# EasyEDA Pro project Complete_project.epro, board PCB8
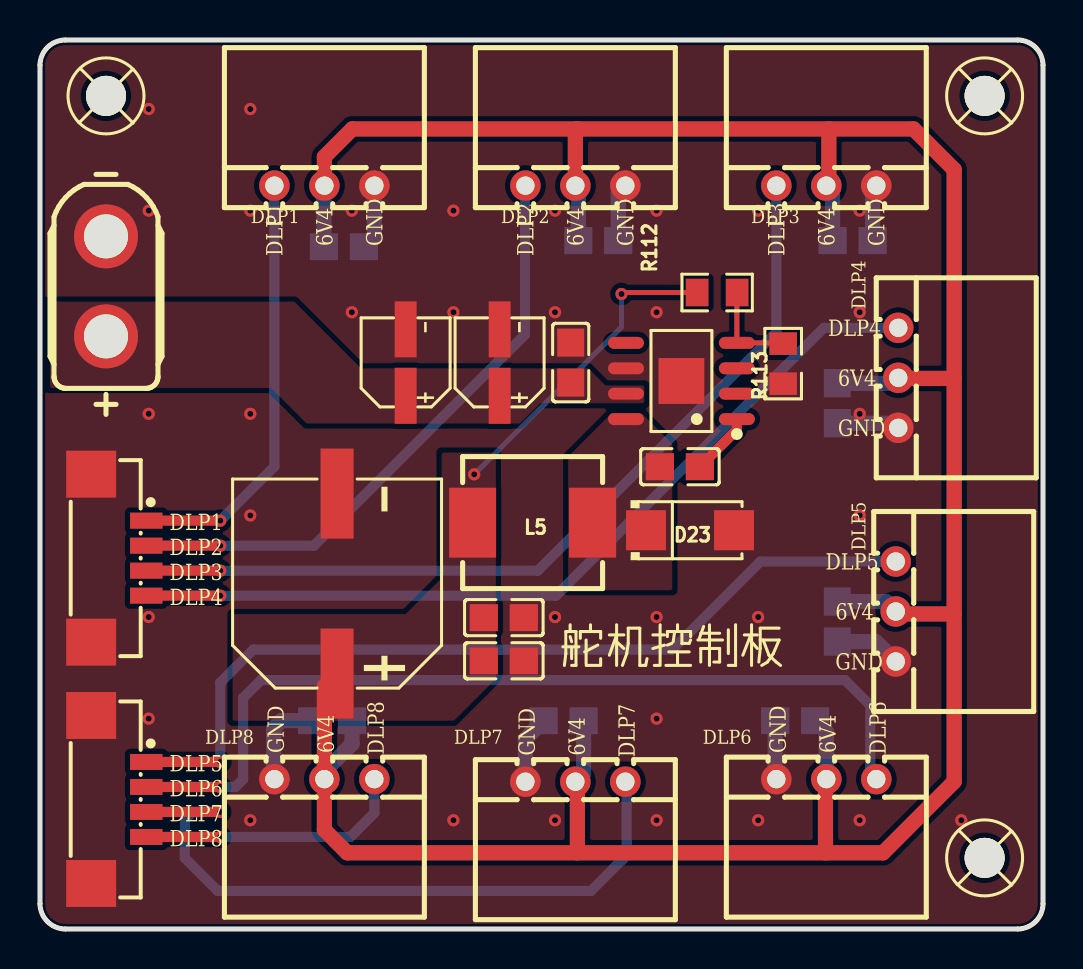
[diagram p20: board, top side]
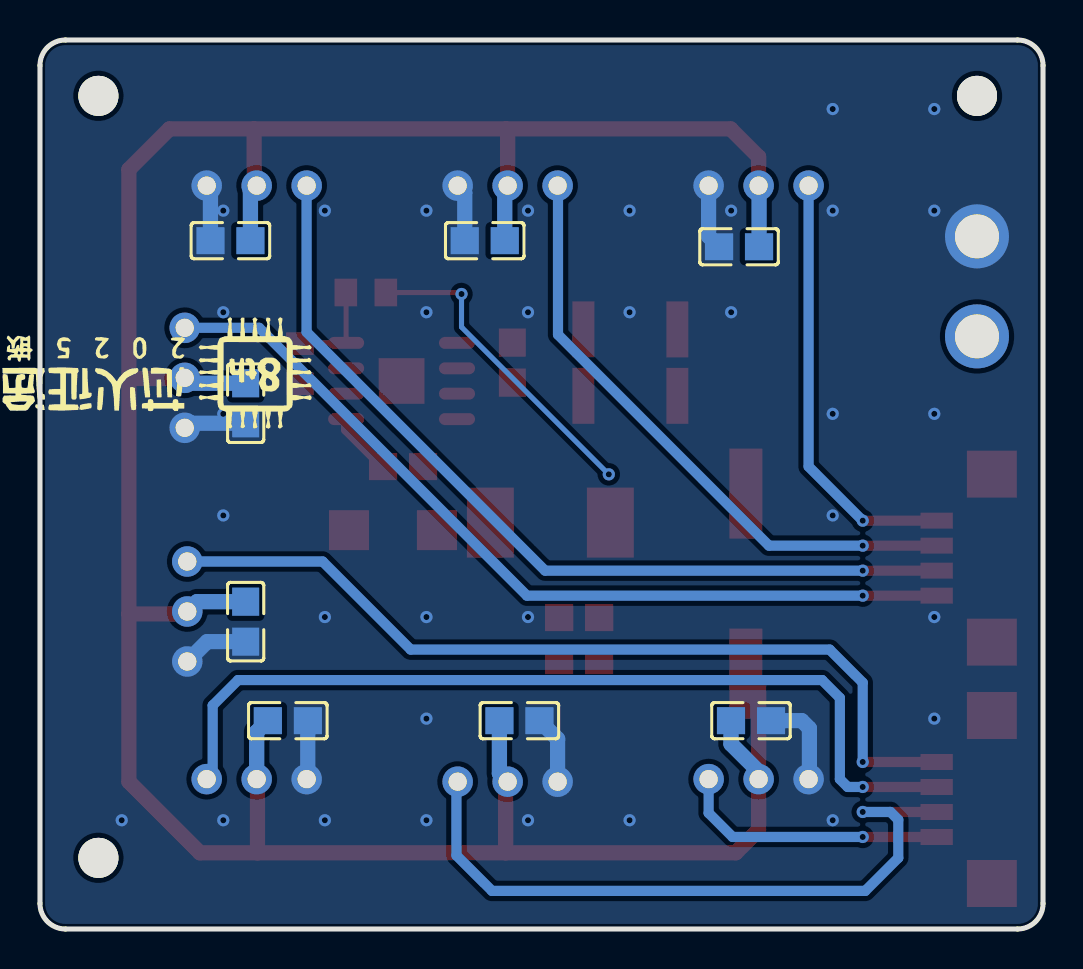
[diagram p21: board, bottom side, seen from below]

Outline 50.16 x 44.45 mm; copper layers: Top Layer, Bottom Layer. Coordinates in mm from the lower left corner of the outline.
Outline path: 0,43.18 0,1.27 arc(0.37,0.37) 1.27,0 48.9,0 arc(49.79,0.37) 50.16,1.27 50.16,43.18 arc(49.79,44.08) 48.9,44.45 1.27,44.45 arc(0.37,44.08) 0,43.18
Stack: Top Layer 0.035mm / Dielectric1 1.51mm FR4 er 4.5 / Bottom Layer 0.035mm

## Design rules (mm)
template: 自定义配置
spacing copperThickness1oz (default): track to track 0.102, other pairs 0.152 to 0.3
spacing copperThickness2oz: track to track 0.203, other pairs 0.152 to 0.3
track width copperThickness1oz (default): min 0.127, default 0.254, max 2.54
track width copperThickness2oz: min 0.203, default 0.254, max 2.54
differential pair differentialPair (default): width min 0.127, default 0.254, max 2.54; gap min 0.152, default 0.152
via viaSize (default): diameter min 0.5, default 0.61, max 10; hole min 0.3, default 0.305, max 6.3

## Placement (name value [footprint] x y rotation side)
C131  4.7uF  [CAP-SMD_BD4.0-L4.3-W4.3-LS5.0-FD]  22.99 28.32 90 top
C132  100nF  [C0805]  26.54 28.32 270 top
C134  100nF  [C0805]  23.2 13.41 180 top
C135  470uF  [CAP-SMD_BD10.0-L10.3-W10.3-LS11.3-FD]  14.86 17.27 90 top
C136  100nF  [C0805]  23.2 15.57 180 top
C137  4.7uF  [CAP-SMD_BD4.0-L4.3-W4.3-LS5.0-FD]  18.29 28.32 90 top
C139  100nF  [C0805]  32 23.11 180 top
C141  100nF  [C0805]  14.6 10.42 0 bottom
C142  100nF  [C0805]  15.2 34.11 180 bottom
C143  100nF  [C0805]  27.92 34.42 180 bottom
C144  100nF  [C0805]  40.64 34.42 180 bottom
C145  100nF  [C0805]  39.88 15.37 90 bottom
C146  100nF  [C0805]  37.77 10.42 0 bottom
C147  100nF  [C0805]  26.19 10.42 0 bottom
C148  100nF  [C0805]  39.88 26.29 90 bottom
CN1  XT30UPB-F30.G.Y  [CONN-TH_XT30UPB-F]  3.3 32.13 90 top
CN111  HC-1.25-4PLT  [CONN-SMD_4P-P1.25_HCTL_HC-1.25-4PLT]  3.94 18.54 270 top
CN112  HC-1.25-4PLT  [CONN-SMD_4P-P1.25_HCTL_HC-1.25-4PLT]  3.94 6.48 270 top
D23  SS56  [SMA_L4.3-W2.6-LS5.2-RD]  32.51 19.94 0 top
DLP1  HC-5264-3AW  [CONN-TH_3P-P2.50_HCTL_HC-5264-3AW]  14.22 37.17 0 top
DLP2  HC-5264-3AW  [CONN-TH_3P-P2.50_HCTL_HC-5264-3AW]  26.78 37.17 0 top
DLP3  HC-5264-3AW  [CONN-TH_3P-P2.50_HCTL_HC-5264-3AW]  39.33 37.17 0 top
DLP4  HC-5264-3AW  [CONN-TH_3P-P2.50_HCTL_HC-5264-3AW]  42.93 27.56 270 top
DLP5  HC-5264-3AW  [CONN-TH_3P-P2.50_HCTL_HC-5264-3AW]  42.8 15.88 270 top
DLP6  HC-5264-3AW  [CONN-TH_3P-P2.50_HCTL_HC-5264-3AW]  39.33 7.49 180 top
DLP7  HC-5264-3AW  [CONN-TH_3P-P2.50_HCTL_HC-5264-3AW]  26.78 7.37 180 top
DLP8  HC-5264-3AW  [CONN-TH_3P-P2.50_HCTL_HC-5264-3AW]  14.22 7.49 180 top
L5  10uH  [IND-SMD_L7.3-W6.8]  24.64 20.32 180 top
R112  5.1K  [R0805]  33.87 31.82 180 top
R113  1.2K  [R0805]  37.17 28.27 90 top
SCREW1  -  [M2螺丝]  3.3 41.66 0 top
SCREW2  -  [M2螺丝]  47.24 3.56 0 top
SCREW3  -  [M2螺丝]  47.24 41.66 0 top
U50  TPS5450DDAR  [SOP-8_L4.9-W3.9-P1.27-LS6.0-BL-EP]  32.08 27.4 90 top

## Footprints (pads in the part's own frame, mm; a bottom-side part is the same pattern mirrored in y, then rotated)
C0805
  rect 1.41x1.35 smd: 1(-1,0) 2(1,0)
CAP-SMD_BD4.0-L4.3-W4.3-LS5.0-FD
  rect 2.8x1.1 smd: 1(-1.661,0) 2(1.661,0)
CAP-SMD_BD10.0-L10.3-W10.3-LS11.3-FD
  rect 4.5x1.65 smd: 1(-4.5,0) 2(4.5,0)
CONN-SMD_4P-P1.25_HCTL_HC-1.25-4PLT
  rect 0.8x1.62 smd: 1(-1.875,1.38) 2(-0.625,1.38) 3(0.625,1.38) 4(1.875,1.38)
  rect 2.35x2.5 smd: 5(-4.2,-1.38) 6(4.2,-1.38)
CONN-TH_3P-P2.50_HCTL_HC-5264-3AW
  round 1.524 hole 0.914: 1(-2.5,0) 2(0,0) 3(2.5,0)
CONN-TH_XT30UPB-F
  round 3.2 hole 2.2: 1(-2.5,0) 2(2.5,0)
IND-SMD_L7.3-W6.8
  rect 2.35x3.5 smd: 1(-3,0) 2(3,0)
M2螺丝
  round 2 hole 2: 1(0,0)
R0805
  rect 1.133x1.377 smd: 1(-1,0) 2(1,0)
SMA_L4.3-W2.6-LS5.2-RD
  rect 2x2 smd: 1(-2.2,0) 2(2.2,0)
SOP-8_L4.9-W3.9-P1.27-LS6.0-BL-EP
  oval 0.6x1.8 smd: 1(-1.905,-2.772) 2(-0.635,-2.772) 3(0.635,-2.772) 4(1.905,-2.772) 5(1.905,2.772) 6(0.635,2.772) 7(-0.635,2.772) 8(-1.905,2.772)
  rect 2.29x2.29 smd: 9(0,0)

## Nets
As in the schematic.

Pads without a net: SCREW1 1; SCREW2 1; SCREW3 1; U50 2 3 5

## Via types
v1: diameter 0.61, hole 0.305, Top Layer to Bottom Layer, 43 vias

## Routing (per net, layer and track width the routed paths; a pad name or vN(x,y) marks a point on that pad's centre or on a via; arc(x,y) is an arc through that point)
+6V4: length 166.1
  Top Layer w0.254: v1(29.08,31.75) 29.16,31.82 R112.2
  Top Layer w0.762: DLP5.2 42.92,15.75 45.72,15.75 ; DLP1.2 14.22,38.61 15.62,40 26.84,40 ; 39.45,40 39.45,37.3 DLP3.2 ; 39.45,40 43.69,40 45.72,37.97 45.72,27.53 ; 39.45,40 26.84,40 ; 26.84,40 26.78,39.94 DLP2.2 ; 39.29,3.81 39.29,7.45 DLP6.2 ; 39.29,3.81 26.88,3.81 ; 39.29,3.81 42.16,3.81 45.72,7.37 45.72,15.75 ; DLP4.2 42.96,27.53 45.72,27.53 ; 45.72,15.75 45.72,27.53 ; 26.88,3.81 26.88,7.26 DLP7.2 ; 26.88,3.81 15.37,3.81 14.22,4.95 DLP8.2 14.22,12.14 C135.1
  Bottom Layer w0.254: v1(29.08,31.75) 29.08,30.1 v1(21.72,22.73)
  Bottom Layer w0.762: C142.2 14.2,37.15 DLP1.2 ; DLP5.2 42.31,16.37 C145.2 ; C141.2 15.6,9.25 14.22,7.87 DLP8.2 ; DLP6.2 39.33,9.86 C146.2 ; C147.2 27.19,7.78 DLP7.2 ; DLP3.2 39.64,36.86 C144.2 ; DLP4.2 42.66,27.29 C148.2 ; C143.2 26.92,37.02 DLP2.2
GND: length 26.5
  Bottom Layer w0.762: C141.1 12.07,10.42 11.68,10.03 11.68,7.53 DLP8.3 ; C142.1 16.72,34.63 DLP1.3 ; C146.1 36.77,7.55 DLP6.3 ; DLP3.3 41.64,36.98 C144.1 ; C147.1 24.28,9.5 DLP7.3 ; DLP5.3 41.81,14.37 C145.1 ; DLP4.3 42.7,25.29 C148.1 ; C143.1 28.92,36.81 DLP2.3
  vias: v1(5.44,41) v1(5.44,35.92) v1(5.44,25.76) v1(5.44,15.6) v1(5.44,10.52) v1(10.52,41) v1(10.52,35.92) v1(10.52,25.76) v1(10.52,20.68) v1(10.52,5.44) v1(15.6,35.92) v1(15.6,30.84) v1(20.68,35.92) v1(20.68,30.84) v1(20.68,5.44) v1(25.76,35.92) v1(25.76,30.84) v1(25.76,15.6) v1(25.76,5.44) v1(30.84,35.92) v1(30.84,30.84) v1(30.84,15.6) v1(30.84,10.52) v1(30.84,5.44) v1(35.92,35.92) v1(35.92,15.6) v1(35.92,5.44) v1(41,35.92) v1(41,30.84) v1(41,25.76) v1(41,20.68) v1(41,5.44) v1(46.08,5.44)
DLP1: length 21.6
  Top Layer w0.508: CN111.1 v1(9.02,20.42)
  Bottom Layer w0.508: DLP1.1 11.72,23.12 v1(9.02,20.42)
DLP2: length 30.8
  Top Layer w0.508: CN111.2 v1(9.02,19.17)
  Bottom Layer w0.508: v1(9.02,19.17) 13.71,19.17 24.26,29.72 24.26,37.15 DLP2.1
DLP3: length 43.8
  Top Layer w0.508: CN111.3 v1(9.02,17.92)
  Bottom Layer w0.508: DLP3.1 36.83,37.17 36.83,29.84 24.9,17.92 v1(9.02,17.92)
DLP4: length 43.2
  Top Layer w0.508: CN111.4 v1(9.02,16.67)
  Bottom Layer w0.508: v1(9.02,16.67) 25.81,16.67 39.2,30.06 DLP4.1
DLP5: length 44
  Top Layer w0.508: CN112.1 v1(9.02,8.35)
  Bottom Layer w0.508: DLP5.1 36.03,18.38 31.62,13.97 10.67,13.97 9.02,12.32 v1(9.02,8.35)
DLP6: length 45.1
  Top Layer w0.508: CN112.2 v1(9.02,7.1)
  Bottom Layer w0.508: DLP6.1 41.53,7.79 41.53,11.18 40.26,12.45 11.05,12.45 10.16,11.56 10.16,7.49 9.77,7.1 v1(9.02,7.1)
DLP7: length 34.8
  Top Layer w0.508: CN112.3 v1(9.02,5.85)
  Bottom Layer w0.508: DLP7.1 29.34,7.3 29.34,3.68 27.56,1.91 8.89,1.91 7.24,3.56 7.24,5.46 7.63,5.85 v1(9.02,5.85)
DLP8: length 13.6
  Top Layer w0.508: CN112.4 v1(9.02,4.6)
  Bottom Layer w0.508: v1(9.02,4.6) 15.52,4.6 16.72,5.8 DLP8.1
$1N574: length 4.9
  Top Layer w0.254: R112.1 34.85,31.81 U50.4 37.13,29.3 R113.2
$1N579: length 3.1
  Top Layer w0.508: C139.1 34.85,24.96 U50.1

## Copper pours and planes (outline as drawn; the poured copper is in the pictures)
+6V4 on Top Layer: 20.09,23.82 20.09,17.55 18.29,15.75 9.63,15.75 9.63,10.41 20.71,10.41 22.8,12.51 22.8,23.82
+12V on Top Layer: 0.5,31.37 12.72,31.37 16.06,28.03 27.43,28.03 28.29,27.18 30.23,27.18 30.23,26.29 25.02,26.29 24,25.27 13.34,25.27 11.56,27.05 0.5,27.05
GND on Top Layer: -2.03,46.74 52.07,46.74 52.07,-2.16 -2.03,-2.16
GND on Bottom Layer: -6.98,51.44 55.5,51.44 55.5,-4.7 -6.98,-4.7
$1N578 on Top Layer: 28.57,25.78 28.57,25.78 30.1,25.78 31.62,24.26 31.62,16.94 26.42,16.94 26.42,23.62

## Text on the board
Top Silkscreen Layer: 舵机控制板 | DLP1 | DLP2 | DLP3 | DLP4 | DLP5 | DLP6 | DLP7 | DLP8 | GND | 6V4
